# EAGLE design beacon (EAGLE 9.5.2)
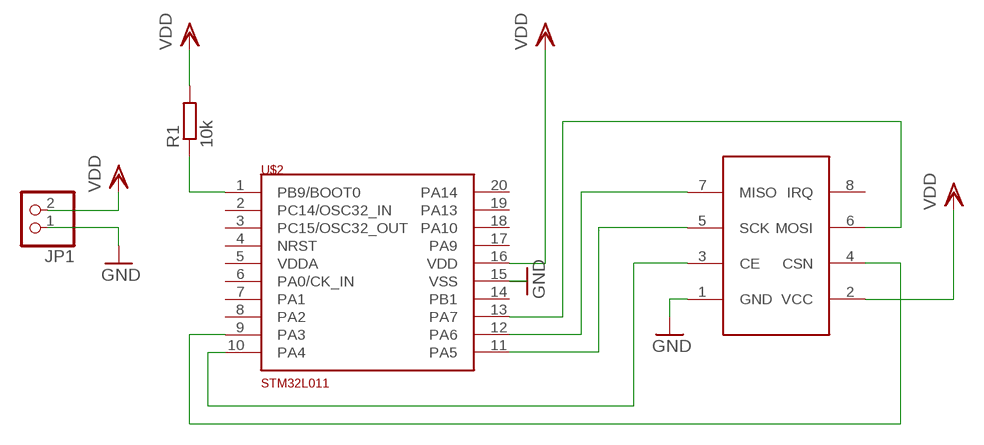
[diagram p0: schematic, sheet 1]

## Parts
JP1  PINHD-1X2  [1X02]
R1  10k  R-EU_R0805  [R0805]
U$1  RF24013  [PIN]
U$2  STM32L011  [SSOP20]

## Nets
CE: U$1.3(CE) U$2.10(PA4)
CSN: U$1.4(CSN) U$2.9(PA3)
GND: JP1.1 U$1.1(GND) U$2.15(VSS)
MISO: U$1.7(MISO) U$2.12(PA6)
MOSI: U$1.6(MOSI) U$2.13(PA7)
N$1: R1.1 U$2.1(PB9/BOOT0)
SCK: U$1.5(SCK) U$2.11(PA5)
VDD: JP1.2 R1.2 U$1.2(VCC) U$2.16(VDD)
Unconnected: U$1.8(IRQ) U$2.2(PC14/OSC32_IN) U$2.3(PC15/OSC32_OUT) U$2.4(NRST) U$2.6(PA0/CK_IN) U$2.7(PA1) U$2.8(PA2) U$2.14(PB1) U$2.17(PA9) U$2.18(PA10) U$2.19(PA13) U$2.20(PA14)

## Power pins joined to a net without a drawn wire
VDDA: U$2.5(VDDA)

## Library data of the parts
JP1 = pinhead:PINHD-1X2: PIN HEADER
R1 = rcl:R-EU_: RESISTOR, European symbol; SPICEPREFIX: R
U$1 = rf24:RF24013
U$2 = st:STM32L011

## Board
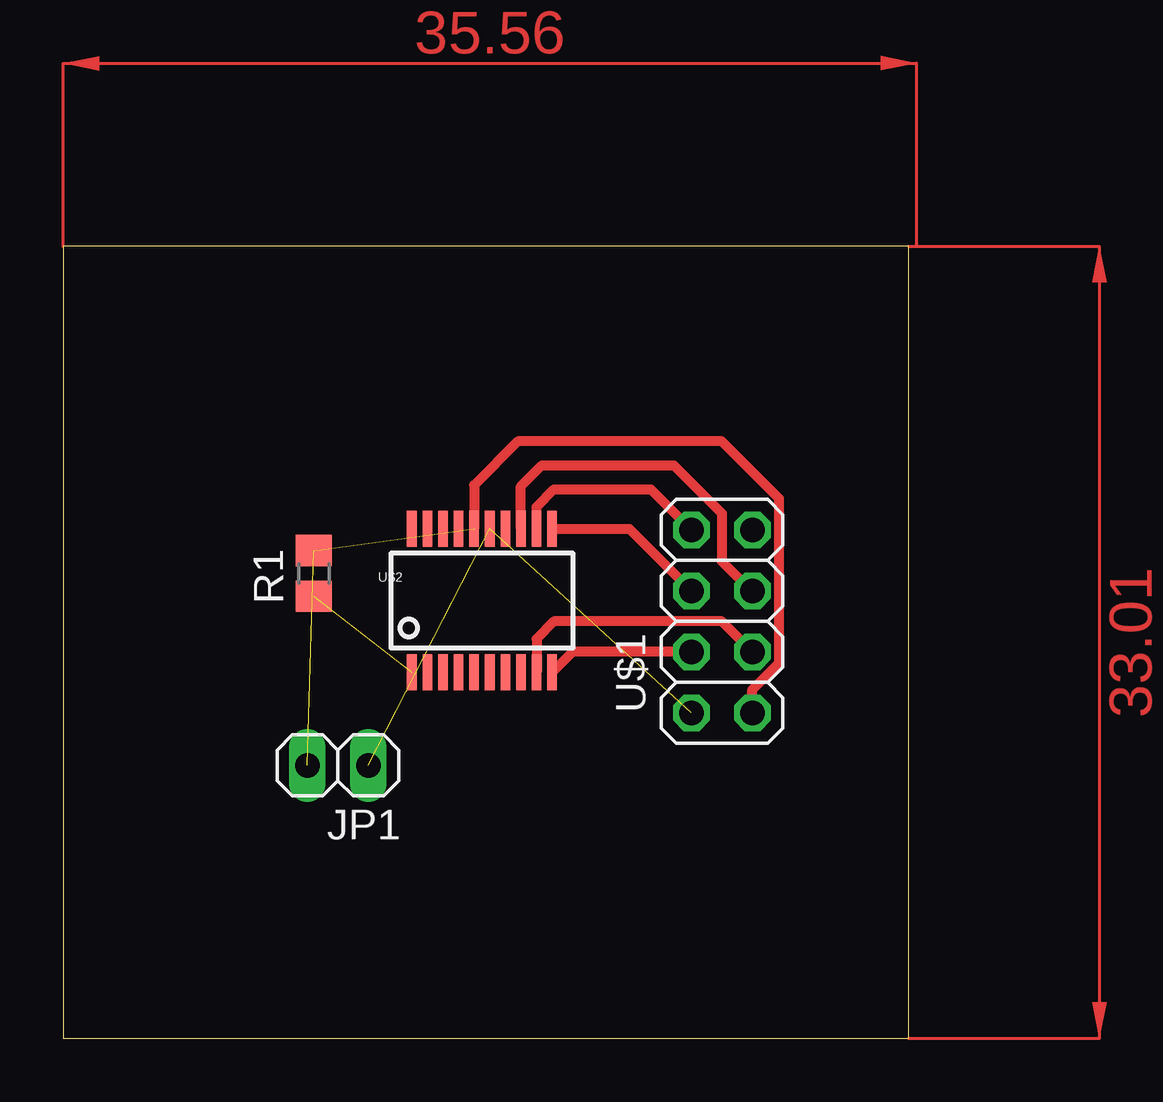
[diagram p1: board, top side]

Size 35.23 x 33.01 mm. Coordinates in mm from the lower left corner, seen from the top.
Outline: 0,0 35.23,0 35.23,33.01 0,33.01 0,0
Copper layers (1*16): Top 0.018mm / dielectric 1.55mm / Bottom 0.018mm
Design rules "default": minimum track width 0.15mm, minimum drill 0.25mm, track to track 0.15mm, track to pad 0.15mm, pad to pad 0.15mm, via to via 0.15mm, smd to smd 0.15mm, copper to edge 40mil, drill to drill 40mil, minimum pad ring 0.125mm, minimum via ring 0.125mm, stop-mask expansion 8mil, vias tented up to drill 0mil, thermal gap 10mil

### Footprints (pad centres in the part's own frame; a part is rotated, then mirrored left to right if it is on the bottom)
1X02 = drill 1.016 long: 1 -1.27,0; 2 1.27,0
R0805 = smd 1.3 x 1.5: 1 -0.95,0; 2 0.95,0
PIN = drill 1.016 octagon: 1 -3.81,1.27; 2 -3.81,-1.27; 3 -1.27,1.27; 4 -1.27,-1.27; 5 1.27,1.27; 6 1.27,-1.27; 7 3.81,1.27; 8 3.81,-1.27
SSOP20 = smd 0.4 x 1.5: 1 -2.925,-3.625; 2 -2.275,-3.625; 3 -1.625,-3.625; 4 -0.975,-3.625; 5 -0.325,-3.625; 6 0.325,-3.625; 7 0.975,-3.625; 8 1.625,-3.625; 9 2.275,-3.625; 10 2.925,-3.625; 11 2.925,2.355; 12 2.275,2.355; 13 1.625,2.355; 14 0.975,2.355; 15 0.325,2.355; 16 -0.325,2.355; 17 -0.975,2.355; 18 -1.625,2.355; 19 -2.275,2.355; 20 -2.925,2.355

### Placement (x,y rotation side)
JP1  11.45,11.38 180 top
R1  10.45,19.38 90 top
U$1  27.45,17.38 90 top
U$2  17.45,18.88 0 top

### Tracks (layer width: path | path; a pad name or v marks a point on that pad's centre or on a via)
CE
  Top 0.406: U$1.3 21.23,16.11 U$2.10
CSN
  Top 0.406: U$1.4 27.45,17.38 20.45,17.38 19.72,16.65 U$2.9
GND  (2 unrouted)
MISO
  Top 0.406: U$1.7 24.49,22.88 20.45,22.88 19.72,22.15 U$2.12
MOSI
  Top 0.406: U$2.13 19.07,23 19.95,23.88 25.45,23.88 27.45,21.88 27.45,19.88 28.68,18.65 U$1.6
N$1  (1 unrouted)
SCK
  Top 0.406: U$2.11 23.6,21.23 U$1.5
VDD  (2 unrouted)
  Top 0.406: U$1.2 28.72,14.53 29.83,15.65 29.83,22.49 27.45,24.88 18.95,24.88 17.12,23.05 U$2.16
(copper drawn outside any net)
  shapes: Top area x2